# Altium schematic sheet Sheet3.SchDoc
size A3
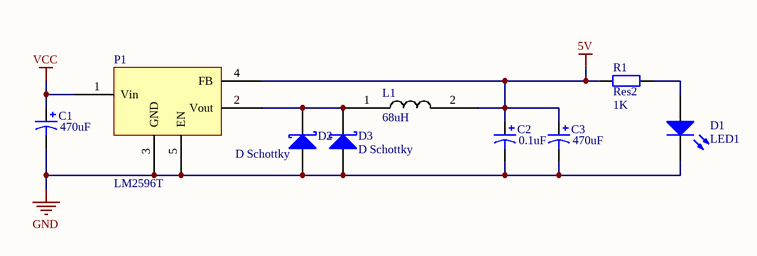
[diagram p0: Sheet3.SchDoc]

## Parts
C1  value 470uF  [C_470uF]  (hidden comment: Cap Pol1)
C2  value 0.1uF  [C-pF]  (hidden comment: Cap Pol1)
C3  value 470uF  [C_470uF]  (hidden comment: Cap Pol1)
D1  LED1  [LED]
D2  D Schottky  [Diode]
D3  D Schottky  [Diode]
L1  68uH  [L-]
P1  LM2596T  [LM2596-ChaJian]
R1  Res2  value 1K  [R]

## Nets
5V: C2.1 C3.1 L1.2 P1.4(FB) R1.2
GND: C1.2 C2.2 C3.2 D1.2(K) D2.1(A) D3.1(A) P1.3(GND) P1.5(EN)
VCC: C1.1 P1.1(Vin)
NetD1_1: D1.1(A) R1.1
NetD2_2: D2.2(K) D3.2(K) L1.1 P1.2(Vout)

## Library data of the parts
C1-C3 = Cap Pol1: Polarized Capacitor (Radial); Published: 8-Jun-2000; LatestRevisionDate: 17-Jul-2002; LatestRevisionNote: Re-released for DXP Platform.; PackageReference: RB7.6-15; Publisher: Altium Limited; PackageDescription: Polarized Capacitor (Radial); 2 Leads
D1 = LED1: Typical RED GaAs LED; Published: 8-Jun-2000; LatestRevisionDate: 08-Jul-2005; LatestRevisionNote: Mech Layer 1 removed.; PackageReference: LED-1; Publisher: Altium Limited; PackageDescription: LED; 2 Leads
D2 D3 = D Schottky: Schottky Diode; Published: 8-Jun-2000; LatestRevisionDate: 17-Jul-2002; LatestRevisionNote: Re-released for DXP Platform.; PackageReference: SMB; Publisher: Altium Limited; PackageDescription: DO-214-AA/SMB; 2 C-Bend Leads; Body 5.3 x 3.6 mm, inc. leads (LxW); Code_JEDEC: DO-214-AA
L1 = L
R1 = Res2: Resistor; Published: 8-Jun-2000; LatestRevisionDate: 17-Jul-2002; LatestRevisionNote: Re-released for DXP Platform.; PackageReference: AXIAL-0.4; Publisher: Altium Limited; PackageDescription: Axial Device, Thru-Hole; 2 Leads; 0.4 in Pin Spacing